# EAGLE schematic LFSWG (EAGLE 6.1)
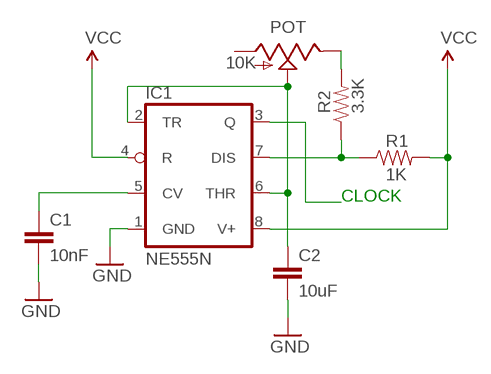
[diagram p0: schematic, sheet 1]

## Parts
C1  10nF  CAP  [E5-5]
C2  10uF  CAP  [E5-5]
IC1  NE555N  [DIL08-ROUND]
POT  10K  POT-RV16AF-20  [POT_ALPHA_RV16AF-20]
R1  1K  RESISTORPTH-1/4W  [AXIAL-0.4]
R2  3.3K  RESISTORPTH-1/4W  [AXIAL-0.4]

## Nets
GND: C1.- C2.- IC1.1(GND)
N$1: IC1.7(DIS) R1.P$1 R2.P$1
N$2: C2.+ IC1.2(TR) IC1.6(THR) POT.2(S)
N$3: IC1.3(Q)
N$4: C1.+ IC1.5(CV)
N$5: POT.3(E) R2.P$2
VCC: IC1.4(R) IC1.8(V+) R1.P$2
Unconnected: POT.1(A)

## Notes on the sheet
- CLOCK

## Library data of the parts
C1 C2 = MCParts:CAP: Capacitor Standard 0603 ceramic capacitor, and 0.1" leaded capacitor.
IC1 = adafruit:*555: TIMER Changed DIP package to have round (not oval) pin pads http://www.ladyada.net/library/pcb/eaglelibrary.html
POT = SparkFun:POT
R1 R2 = MCParts:RESISTOR: Resistor Basic schematic elements and footprints for 0603, 1206, and PTH resistors.